# EAGLE design Control board (EAGLE 7.3.0)
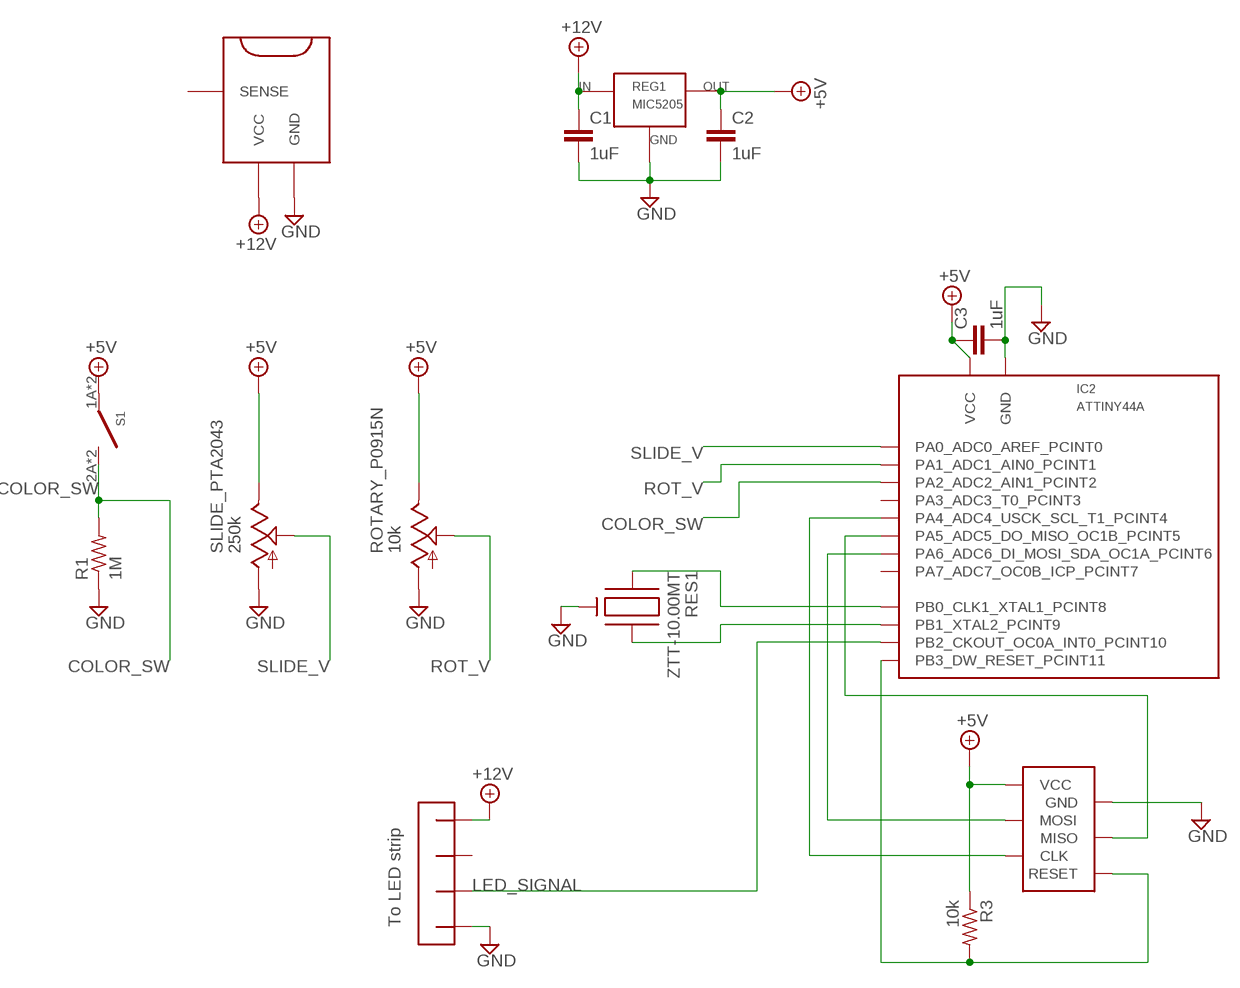
[diagram p0: schematic, sheet 1]

## Parts
C1  1uF  C-EUC0603  [C0603]
C2  1uF  C-EUC0603  [C0603]
C3  1uF  C-EUC0603  [C0603]
CONN1  4-PIN-RIGHT-ANGLE  [S5440]
IC2  ATTINY44A  ATTINY44AQFN-20  [QFN-20]
POW1  PJ-202A  [PJ202A]
R1  1M  R-US_0207/7  [0207/7]
R3  10k  R-US_0207/7  [0207/7]
REG1  MIC5205  [SOT-23-5]
RES1  ZTT-10.00MT  ZTT-16.00MX  [3-PIN-THROUGH-HOLE]
ROTARY_P0915N  10k  P0915N  [P0915N]
S1  D6R00  [D6R00]
SLIDE_PTA2043  250k  PTA2043  [PTA2043]
U$1  ISP  [ISP]

## Nets
+5V: C2.1 C3.1 IC2.P$9(VCC) R3.1 REG1.5(OUT) ROTARY_P0915N.R13(B) S1.1A S1.1B SLIDE_PTA2043.P3(B) U$1.VCC
+12V: C1.1 CONN1.P$4 POW1.1(VCC) REG1.1(IN) REG1.3(IN)
COLOR_SW: IC2.P$3(PA2_ADC2_AIN1_PCINT2) R1.2 S1.2A S1.2B
GND: C1.2 C2.2 C3.2 CONN1.P$1 IC2.P$8(GND) IC2.PAD(GND) POW1.2(GND) R1.1 REG1.2(GND) RES1.2(GND) ROTARY_P0915N.R11(A) SLIDE_PTA2043.P1(A) U$1.GND
LED_SIGNAL: CONN1.P$2 IC2.P$14(PB2_CKOUT_OC0A_INT0_PCINT10)
MISO: IC2.P$20(PA5_ADC5_DO_MISO_OC1B_PCINT5) U$1.MISO
MOSI: IC2.P$16(PA6_ADC6_DI_MOSI_SDA_OC1A_PCINT6) U$1.MOSI
N$2: IC2.P$11(PB0_CLK1_XTAL1_PCINT8) RES1.1(X1)
N$4: IC2.P$12(PB1_XTAL2_PCINT9) RES1.3(X2)
RESET: IC2.P$13(PB3_DW_RESET_PCINT11) R3.2 U$1.RESET
ROT_V: IC2.P$4(PA1_ADC1_AIN0_PCINT1) ROTARY_P0915N.R12(S)
SCK: IC2.P$1(PA4_ADC4_USCK_SCL_T1_PCINT4) U$1.SCK(CLK)
SLIDE_V: IC2.P$5(PA0_ADC0_AREF_PCINT0) SLIDE_PTA2043.P2(S)
Unconnected: CONN1.P$3 IC2.P$2(PA3_ADC3_T0_PCINT3) IC2.P$15(PA7_ADC7_OC0B_ICP_PCINT7) POW1.3(SENSE)

## Notes on the sheet
- To LED strip

## Library data of the parts
C1-C3 = resistor:C-EU: CAPACITOR, European symbol
CONN1 = RGB LED project:4-PIN-RIGHT-ANGLE: Right-angle pin headers using DigiKey S5440
IC2 = RGB LED project:ATTINY44A: AVR 8-bit microcontroller
POW1 = RGB LED project:PJ-202A: Barrel jack for plug w/ 2.1mm inner diameter, 5.5mm outer diameter
R1 R3 = resistor:R-US_: RESISTOR, American symbol
REG1 = RGB LED project:MIC5205: 150mA 5V voltage regulator
RES1 = RGB LED project:ZTT-16.00MX: 16Mhz through-hole ceramic resonator
ROTARY_P0915N = RGB LED project:P0915N: P0915N vertical rotary potentiometer
S1 = RGB LED project:D6R00: Pushbutton switch
SLIDE_PTA2043 = RGB LED project:PTA2043: Bourns low-profile linear slide potentiometer
U$1 = RGB LED project:ISP: In-system programming header

## Board
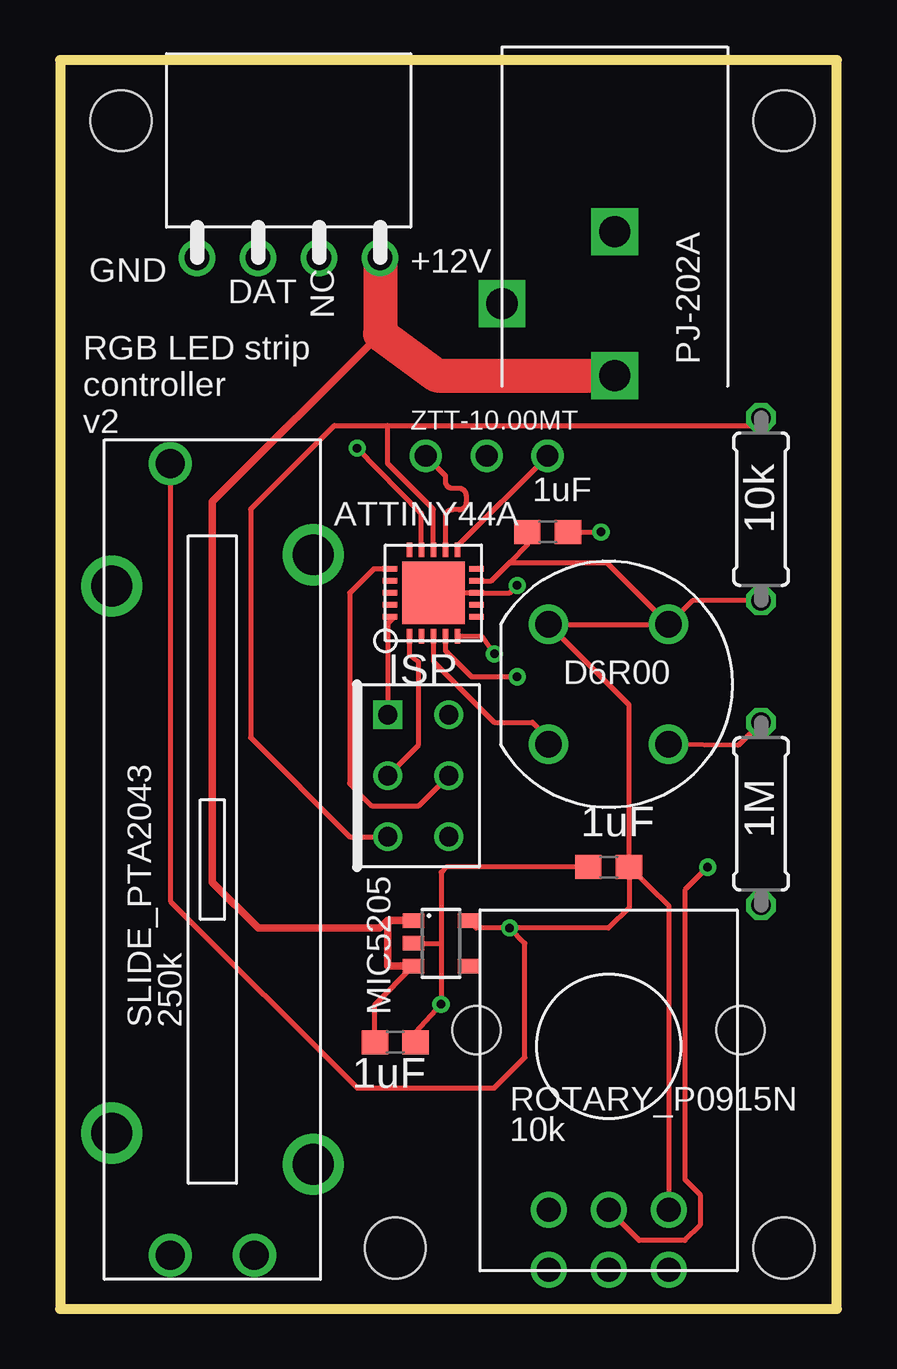
[diagram p1: board, top side]
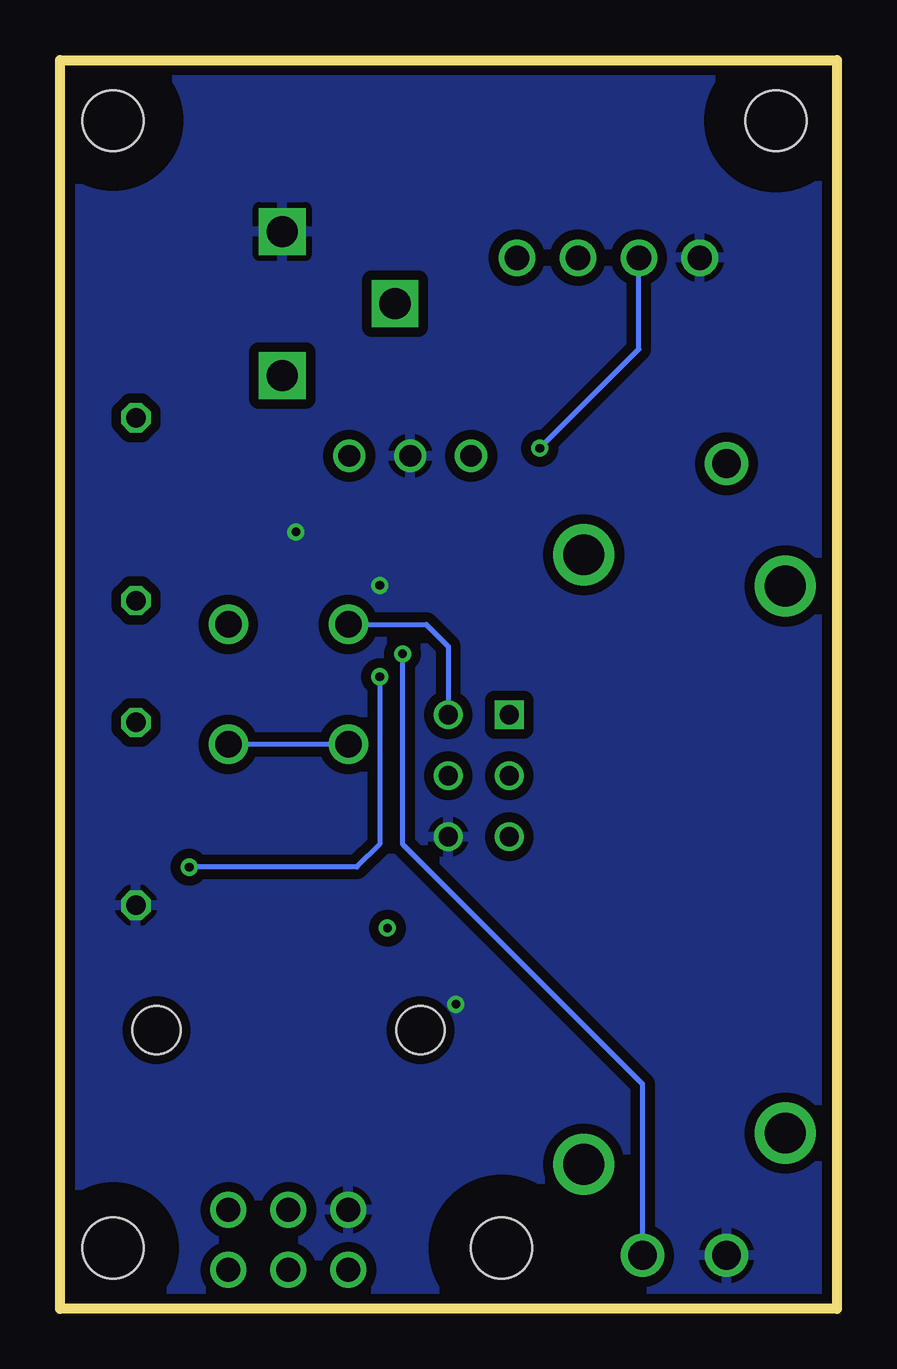
[diagram p2: board, bottom side, seen from below]

Size 32.37 x 52.06 mm. Coordinates in mm from the lower left corner, seen from the top.
Outline: 0,0 32.37,0 32.37,52.06 0,52.06 0,0
Copper layers (1*16): Top 0.0356mm / dielectric 1.5011mm / Bottom 0.0356mm
Design rules "oshpark_eagle_design_rules": minimum track width 6mil, minimum drill 13mil, track to track 6mil, track to pad 6mil, pad to pad 6mil, via to via 6mil, smd to smd 6mil, copper to edge 15mil, drill to drill 6mil, minimum pad ring 7mil, minimum via ring 7mil, stop-mask expansion 4mil, vias tented up to drill 0mil, thermal gap 10mil
Holes 2.54 mm at 2.54,49.53 30.16,49.53 13.97,2.54 30.16,2.54
bRestrict: area 0.1,47.1 to 5,52; area 27.7,47.1 to 32.6,51.9; area 11.4,0 to 16.5,5.1; area 27.9,0.3 to 32.4,4.8

### Footprints (pad centres in the part's own frame; a part is rotated, then mirrored left to right if it is on the bottom)
C0603 = smd 1.1 x 1: 1 -0.85,0; 2 0.85,0
S5440 = drill 1.016: P$1 -3.81,0; P$2 -1.27,0; P$3 1.27,0; P$4 3.81,0
QFN-20 = smd 0.6 x 0.23: P$1 -1.8,1; P$2 -1.8,0.5; P$3 -1.8,0; P$4 -1.8,-0.5; P$5 -1.8,-1; P$11 1.8,-1; P$12 1.8,-0.5; P$13 1.8,0; P$14 1.8,0.5; P$15 1.8,1 | smd 0.23 x 0.6: P$6 -1,-1.8; P$7 -0.5,-1.8; P$8 0,-1.8; P$9 0.5,-1.8; P$10 1,-1.8; P$16 1,1.8; P$17 0.5,1.8; P$18 0,1.8; P$19 -0.5,1.8; P$20 -1,1.8 | smd 2.6 x 2.6: PAD 0,0
PJ202A = drill 1.3 square: 1 -3,-4.7; 2 3,-4.7; 3 0,0
0207/7 = drill 0.813 octagon: 1 -3.81,0; 2 3.81,0
SOT-23-5 = smd 0.6 x 0.9: 1 -0.95,-1.15; 2 0,-1.15; 3 0.95,-1.15; 4 0.95,1.15; 5 -0.95,1.15
3-PIN-THROUGH-HOLE = drill 0.9: 1 -2.54,0; 2 0,0; 3 2.54,0
P0915N = drill 1: R11 -2.5,0; R12 0,0; R13 2.5,0; R21 -2.5,-2.5; R22 0,-2.5; R23 2.5,-2.5 | hole 2: -5.5,7.5; 5.5,7.5
D6R00 = drill 1.1: 1A -2.5,2.5; 1B 2.5,2.5; 2A -2.5,-2.5; 2B 2.5,-2.5
PTA2043 = drill 1.7: MNT1 -11.4,4.2; MNT2 11.4,4.2; MNT3 -12.7,-4.2; MNT4 12.7,-4.2 | drill 1.2: P1 -16.5,1.75; P2 -16.5,-1.75; P3 16.5,1.75
ISP = drill 0.8: GND 1.27,-2.54; MOSI 1.27,0; RESET -1.27,-2.54; SCK -1.27,0; VCC 1.27,2.54 | drill 0.8 square: MISO -1.27,2.54

### Placement (x,y rotation side)
C1  13.97,11.11 0 top
C2  22.86,18.41 180 top
C3  20.32,32.38 0 top
CONN1  9.53,43.81 0 top
IC2  15.56,29.84 90 top
POW1  18.41,41.91 90 top
R1  29.21,20.64 90 top
R3  29.21,33.34 90 top
REG1  15.88,15.24 270 top
RES1  17.78,35.56 180 top
ROTARY_P0915N  22.86,4.13 0 top
S1  22.86,26.04 0 top
SLIDE_PTA2043  6.35,18.73 90 top
U$1  14.92,22.23 0 top

### Tracks (layer width: path | path; a pad name or v marks a point on that pad's centre or on a via)
+5V  (via drill 0.36)
  Top 0.203: v18.73,15.88 17.34,15.88 REG1.5 | ROTARY_P0915N.R13 25.36,16.83 C2.1 | C2.1 23.71,16.73 22.86,15.88 v18.73,15.88 | S1.1B S1.1A 23.71,25.18 C2.1 | IC2.P$9 17.96,30.34 18.73,31.11 | 18.73,31.11 22.78,31.11 S1.1B | R3.1 26.35,29.53 S1.1B | C3.1 19.47,31.85 18.73,31.11 | SLIDE_PTA2043.P3 4.6,16.99 12.38,9.21 18.1,9.21 19.37,10.48 19.37,15.24 v18.73,15.88
  Bottom 0.203: S1.1A 17.11,28.54 16.19,27.62 U$1.VCC
+12V
  Top 0.203: 14.61,16.31 REG1.1 | C1.1 13.12,12.69 REG1.3
  Top 0.305: REG1.1 13.65,16.19 | REG1.3 13.65,14.29 13.65,16.19 | 13.34,40.64 6.35,33.66 6.35,17.78 8.26,15.88 13.33,15.88 13.65,16.19
  Top 1.422: CONN1.P$4 13.34,40.64 15.7,38.91 POW1.1
COLOR_SW
  Top 0.203: R1.2 28.26,23.5 S1.2B | S1.2A 20.36,23.77 19.68,24.45 18.1,24.45 15.56,26.99 IC2.P$3
  Bottom 0.203: S1.2A S1.2B
GND  (via drill 0.36)
  Top 0.203: C2.2 16.09,18.41 15.88,18.2 15.88,15.24 | REG1.2 15.88,15.24 | 15.88,15.24 v15.88,12.7 14.82,11.53 C1.2 | IC2.PAD IC2.P$8 18.73,29.84 v19.05,30.16 | C3.2 v22.54,32.38
  pour Bottom (isolate 0.406): 0,52.07 32.7,52.07 32.7,0 0,0
LED_SIGNAL  (via drill 0.36)
  Top 0.203: IC2.P$14 15.06,33.16 v12.38,35.88
  Bottom 0.203: v12.38,35.88 8.26,40.01 CONN1.P$2
MISO
  Top 0.203: IC2.P$20 13.92,28.84 13.65,28.57 U$1.MISO
MOSI
  Top 0.203: U$1.MOSI 14.92,20.95 13.02,20.95 12.06,21.91 12.06,29.84 13.06,30.84 IC2.P$16
N$2
  Top 0.203: IC2.P$11 16.56,31.8 RES1.1
N$4
  Top 0.203: IC2.P$12 16.06,33.02 arc-90 16.35,33.31 16.63,33.31 arc90 16.92,33.6 16.92,33.92 arc90 16.63,34.21 16.35,34.21 arc-90 16.06,34.5 16.06,34.74 RES1.3
RESET
  Top 0.203: U$1.RESET 12.06,19.68 7.94,23.81 7.94,33.34 11.43,36.83 13.65,36.83 | R3.2 28.89,36.83 13.65,36.83 | IC2.P$13 15.56,33.34 13.65,35.24 13.65,36.83
ROT_V  (via drill 0.36)
  Top 0.203: v26.99,18.41 26.04,17.46 26.04,5.4 26.67,4.76 26.67,3.49 26.04,2.86 24.13,2.86 ROTARY_P0915N.R12 | IC2.P$4 16.06,27.44 17.14,26.35 v19.05,26.35
  Bottom 0.203: v19.05,26.35 19.05,19.37 20,18.41 v26.99,18.41
SCK
  Top 0.203: IC2.P$1 14.56,27.26 14.92,26.99 14.92,23.5 U$1.SCK
SLIDE_V  (via drill 0.36)
  Top 0.203: IC2.P$5 17.57,28.05 v18.1,27.3
  Bottom 0.203: SLIDE_PTA2043.P2 8.1,9.37 18.1,19.37 v18.1,27.3

### Text on the board
tPlace: GND | +12V | DAT | NC | RGB LED strip / controller / v2